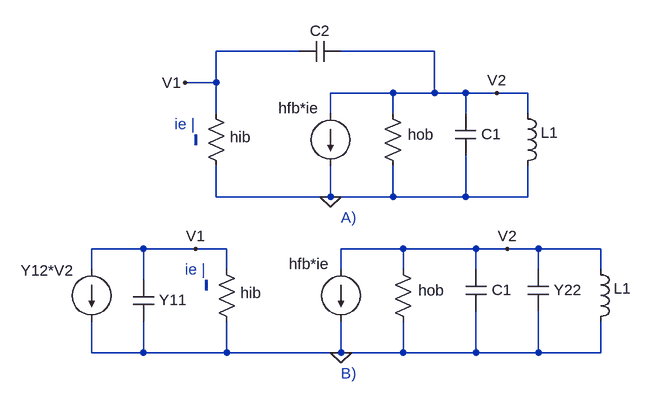
[diagram p0: schematic tx_small-signal.asc]
tx_small-signal.asc, the LTspice schematic file:
Version 4
SHEET 1 880 680
WIRE 176 48 48 48
WIRE 384 48 240 48
WIRE 48 96 48 48
WIRE 48 96 0 96
WIRE 320 112 224 112
WIRE 384 112 384 48
WIRE 384 112 320 112
WIRE 432 112 384 112
WIRE 480 112 432 112
WIRE 528 112 480 112
WIRE 48 144 48 96
WIRE 224 144 224 112
WIRE 320 144 320 112
WIRE 432 144 432 112
WIRE 528 144 528 112
WIRE 48 272 48 224
WIRE 224 272 224 224
WIRE 224 272 48 272
WIRE 320 272 320 224
WIRE 320 272 224 272
WIRE 432 272 432 208
WIRE 432 272 320 272
WIRE 528 272 528 224
WIRE 528 272 432 272
WIRE -64 352 -144 352
WIRE 16 352 -64 352
WIRE 64 352 16 352
WIRE 336 352 240 352
WIRE 448 352 336 352
WIRE 496 352 448 352
WIRE 544 352 496 352
WIRE 640 352 544 352
WIRE -144 384 -144 352
WIRE 64 384 64 352
WIRE 240 384 240 352
WIRE 336 384 336 352
WIRE 448 384 448 352
WIRE 544 384 544 352
WIRE 640 384 640 352
WIRE -64 400 -64 352
WIRE -144 512 -144 464
WIRE -64 512 -64 464
WIRE -64 512 -144 512
WIRE 64 512 64 464
WIRE 64 512 -64 512
WIRE 240 512 240 464
WIRE 240 512 64 512
WIRE 336 512 336 464
WIRE 336 512 240 512
WIRE 448 512 448 448
WIRE 448 512 336 512
WIRE 544 512 544 448
WIRE 544 512 448 512
WIRE 640 512 640 464
WIRE 640 512 544 512
FLAG 0 96 V1
FLAG 480 112 V2
FLAG 224 272 0
FLAG 16 352 V1
FLAG 496 352 V2
FLAG 240 512 0
BUSTAP 16 176 16 192
BUSTAP 32 400 32 416
SYMBOL res 32 128 R0
WINDOW 0 37 52 Left 2
SYMATTR InstName hib
SYMATTR Value ""
SYMBOL res 304 128 R0
WINDOW 0 39 48 Left 2
SYMATTR InstName hob
SYMATTR Value ""
SYMBOL current 224 144 R0
WINDOW 0 -80 -9 Left 2
SYMATTR InstName hfb*ie
SYMATTR Value ""
SYMBOL cap 416 144 R0
WINDOW 0 40 31 Left 2
SYMATTR InstName C1
SYMATTR Value ""
SYMBOL ind 512 128 R0
WINDOW 0 36 45 Left 2
SYMATTR InstName L1
SYMATTR Value ""
SYMBOL cap 240 32 R90
WINDOW 0 0 32 VBottom 2
WINDOW 3 32 32 VTop 2
SYMATTR InstName C2
SYMATTR Value ""
SYMBOL res 48 368 R0
WINDOW 0 37 52 Left 2
SYMATTR InstName hib
SYMATTR Value ""
SYMBOL res 320 368 R0
WINDOW 0 39 48 Left 2
SYMATTR InstName hob
SYMATTR Value ""
SYMBOL current 240 384 R0
WINDOW 0 -80 -9 Left 2
SYMATTR InstName hfb*ie
SYMATTR Value ""
SYMBOL cap 432 384 R0
WINDOW 0 40 31 Left 2
SYMATTR InstName C1
SYMATTR Value ""
SYMBOL ind 624 368 R0
WINDOW 0 36 45 Left 2
SYMATTR InstName L1
SYMATTR Value ""
SYMBOL cap 528 384 R0
WINDOW 0 40 31 Left 2
SYMATTR InstName Y22
SYMATTR Value ""
SYMBOL cap -80 400 R0
WINDOW 0 40 31 Left 2
SYMATTR InstName Y11
SYMATTR Value ""
SYMBOL current -144 384 R0
WINDOW 0 -109 1 Left 2
SYMATTR InstName Y12*V2
SYMATTR Value ""
TEXT -16 160 Left 2 ;ie |
TEXT 240 304 Left 2 ;A)
TEXT 0 384 Left 2 ;ie |
TEXT 240 544 Left 2 ;B)

The netlist it stands for:
* tx_small-signal.asc
R§hib V1 0
R§hob V2 0
I§hfb*ie V2 0
C1 V2 0
L1 V2 0
C2 V2 V1
R§hib V1 0
R§hob V2 0
I§hfb*ie V2 0
C1 V2 0
L1 V2 0
C§Y22 V2 0
C§Y11 V1 0
I§Y12*V2 V1 0
* ie |
* A)
* ie |
* B)
.backanno
.end